# Altium schematic sheet [11] - POWERS.SchDoc: IMXBB
size A3; DocumentNumber: 11; Revision: 2.0; SheetNumber: 11; SheetTotal: 13
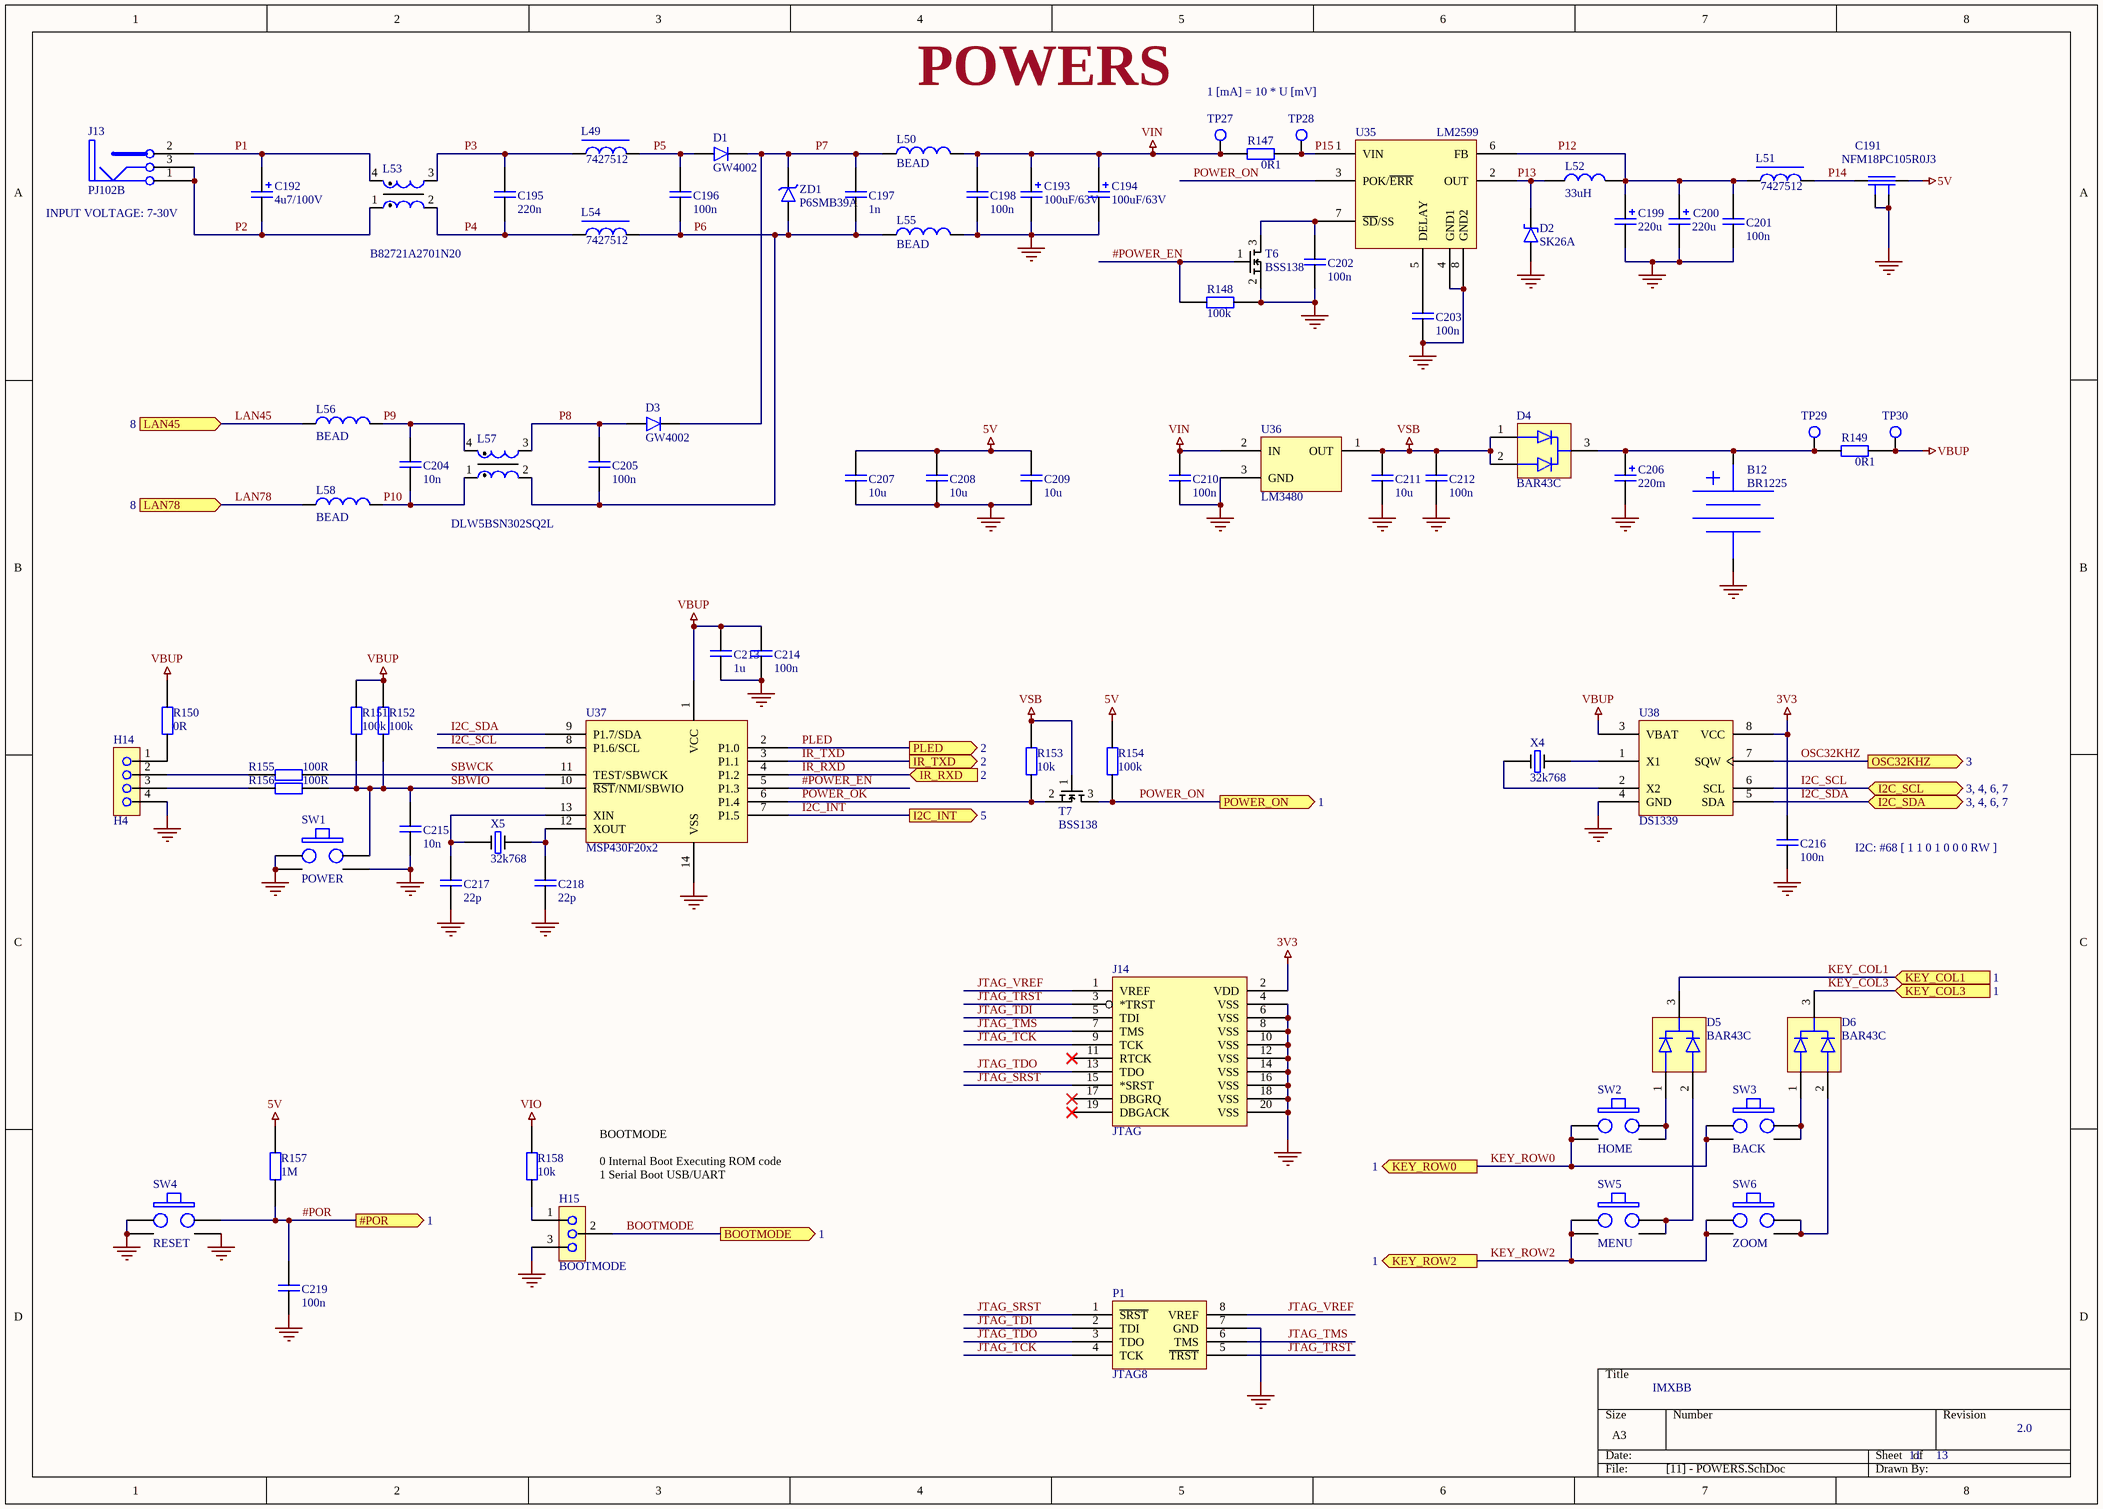
[diagram p0: [11] - POWERS.SchDoc]

## Parts
B12  BR1225  [BR1225]
C191  NFM18PC105R0J3  [NFM18P]
C192  4u7/100V  [EC2/5]
C193  100uF/63V  [EC5/10]
C194  100uF/63V  [EC5/10]
C195  220n  [1206]
C196  100n  [1206]
C197  1n  [0805]
C198  100n  [1206]
C199  220u  [EC5/10]
C200  220u  [EC5/10]
C201  100n  [0603]
C202  100n  [0603]
C203  100n  [0603]
C204  10n  [0603]
C205  100n  [0603]
C206  220m  [SC5/13]
C207  10u  [0805]
C208  10u  [0805]
C209  10u  [0805]
C210  100n  [0603]
C211  10u  [0805]
C212  100n  [0603]
C213  1u  [0603]
C214  100n  [0603]
C215  10n  [0603]
C216  100n  [0603]
C217  22p  [0603]
C218  22p  [0603]
C219  100n  [0603]
D1  GW4002  [MELF]
D2  SK26A  [SMB]
D3  GW4002  [MELF]
D4  BAR43C  [SOT23]
D5  BAR43C  [SOT23]
D6  BAR43C  [SOT23]
H14  H4  [H1x4]
H15  BOOTMODE  [H1x3]
J13  PJ102B  [POWER_JACK_5.5/2.1MM_NS]
J14  JTAG  [H2x10]
L49  7427512  [7427512]
L50  BEAD  [0805]
L51  7427512  [7427512]
L52  33uH  [L127_NS]
L53  B82721A2701N20  [42H17]
L54  7427512  [7427512]
L55  BEAD  [0805]
L56  BEAD  [0805]
L57  DLW5BSN302SQ2L  [DLW5BSN]
L58  BEAD  [0805]
P1  JTAG8  [47041-0001]
R147  0R1  [0603]
R148  100k  [0603]
R149  0R1  [0603]
R150  0R  [0603]
R151  100k  [0603]
R152  100k  [0603]
R153  10k  [0603]
R154  100k  [0603]
R155  100R  [0603]
R156  100R  [0603]
R157  1M  [0603]
R158  10k  [0603]
SW1  POWER  [BUTTON_RA_NS]
SW2  HOME  [BUTTON_KSM61X]
SW3  BACK  [BUTTON_KSM61X]
SW4  RESET  [BUTTON_RA_NS]
SW5  MENU  [BUTTON_KSM61X]
SW6  ZOOM  [BUTTON_KSM61X]
T6  BSS138  [SOT23]
T7  BSS138  [SOT23]
TP27  TESTPOINT  [TESTPOINT_2mm]  (value not drawn)
TP28  TESTPOINT  [TESTPOINT_2mm]  (value not drawn)
TP29  TESTPOINT  [TESTPOINT_2mm]  (value not drawn)
TP30  TESTPOINT  [TESTPOINT_2mm]  (value not drawn)
U35  LM2599  [TO263_7]
U36  LM3480  [SOT23]
U37  MSP430F20x2  [TSSOP14]
U38  DS1339  [uSOP8]
X4  32k768  [SMQ32S]
X5  32k768  [SMQ32S]
ZD1  P6SMB39A  [DO214AA]

## Ports
#POR (out, see 1), BOOTMODE (out, see 1), I2C_INT (out, see 5), I2C_SCL (bidir, see 3, 4, 6, 7), I2C_SDA (bidir, see 3, 4, 6, 7), IR_RXD (in, see 2), IR_TXD (out, see 2), KEY_COL1 (in, see 1), KEY_COL3 (in, see 1), KEY_ROW0 (out, see 1), KEY_ROW2 (out, see 1), LAN45 (in, see 8), LAN78 (in, see 8), OSC32KHZ (out, see 3), PLED (out, see 2), POWER_ON (out, see 1)

## Nets
3V3: C216.2 J14.2(VDD) U38.8(VCC)
5V: C191.3 C207.2 C208.2 C209.2 R154.2 R157.2
GND: B12.2(CATHODE) C191.2 C191.4 C193.2 C194.2 C198.2 C199.2 C200.2 C201.2 C202.1 C203.1 C206.2 C207.1 C208.1 C209.1 C210.1 C211.1 C212.1 C213.1 C214.2 C215.2 C216.1 C217.1 C218.1 C219.1 D2.2 H14.4 H15.3 J14.4(VSS) J14.6(VSS) J14.8(VSS) J14.10(VSS) J14.12(VSS) J14.14(VSS) J14.16(VSS) J14.18(VSS) J14.20(VSS) L55.1 P1.7(GND) R148.1 SW1.2 SW1.3 SW1.4 SW4.2 SW4.3 SW4.4 T6.2(S) U35.4(GND1) U35.8(GND2) U36.3(GND) U37.14(VSS) U38.4(GND)
VBUP: C213.2 C214.1 R149.2 R150.2 R151.2 R152.2 TP30.1 U37.1(VCC) U38.3(VBAT)
VIN: C193.1 C194.1 C198.1 C210.2 L50.1 R147.1 TP27.1 U36.2(IN)
VIO: R158.2
VSB: C211.2 C212.2 D4.1 D4.2 R153.1 T7.1(G) U36.1(OUT)
#POR: C219.2 R157.1 SW4.1 ; port #POR
#POWER_EN: R148.2 T6.1(G) U37.5(P1.3)
BOOTMODE: H15.2 ; port BOOTMODE
I2C_INT: U37.7(P1.5) ; port I2C_INT
I2C_SCL: U37.8(P1.6/SCL) U38.6(SCL) ; port I2C_SCL
I2C_SDA: U37.9(P1.7/SDA) U38.5(SDA) ; port I2C_SDA
IR_RXD: U37.4(P1.2) ; port IR_RXD
IR_TXD: U37.3(P1.1) ; port IR_TXD
JTAG_SRST: J14.15(*SRST) P1.1(~{SRST})
JTAG_TCK: J14.9(TCK) P1.4(TCK)
JTAG_TDI: J14.5(TDI) P1.2(TDI)
JTAG_TDO: J14.13(TDO) P1.3(TDO)
JTAG_TMS: J14.7(TMS) P1.6(TMS)
JTAG_TRST: J14.3(*TRST) P1.5(~{TRST})
JTAG_VREF: J14.1(VREF) P1.8(VREF)
KEY_COL1: D5.3 ; port KEY_COL1
KEY_COL3: D6.3 ; port KEY_COL3
KEY_ROW0: SW2.1 SW2.3 SW3.1 SW3.3 ; port KEY_ROW0
KEY_ROW2: SW5.1 SW5.3 SW6.1 SW6.3 ; port KEY_ROW2
LAN45: L56.1 ; port LAN45
LAN78: L58.1 ; port LAN78
OSC32KHZ: U38.7(SQW) ; port OSC32KHZ
P1: C192.1 J13.2 L53.4
P2: C192.2 J13.1 J13.3 L53.1
P3: C195.1 L49.2 L53.3
P4: C195.2 L53.2 L54.2
P5: C196.1 D1.1 L49.1
P6: C196.2 C197.2 C205.2 L54.1 L55.2 L57.2 ZD1.2
P7: C197.1 D1.2 D3.2 L50.2 ZD1.1
P8: C205.1 D3.1 L57.3
P9: C204.1 L56.2 L57.4
P10: C204.2 L57.1 L58.2
P12: C199.1 C200.1 C201.1 L51.2 L52.2 U35.6(FB)
P13: D2.1 L52.1 U35.2(OUT)
P14: C191.1 L51.1
P15: R147.2 TP28.1 U35.1(VIN)
PLED: U37.2(P1.0) ; port PLED
POWER_OK: R153.2 T7.2(S) U37.6(P1.4)
POWER_ON: R154.1 T7.3(D) U35.3(POK/~{ERR}) ; port POWER_ON
SBWCK: R155.2 U37.11(TEST/SBWCK)
SBWIO: C215.1 R151.1 R152.1 R156.2 SW1.1 U37.10(~{RST}/NMI/SBWIO)
NetB12_1: B12.1(ANODE) C206.1 D4.3 R149.1 TP29.1
NetC202_2: C202.2 T6.3(D) U35.7(~{SD}/SS)
NetC203_2: C203.2 U35.5(DELAY)
NetC217_2: C217.2 U37.13(XIN) X5.1
NetC218_2: C218.2 U37.12(XOUT) X5.2
NetD5_1: D5.1 SW2.2 SW2.4
NetD5_2: D5.2 SW5.2 SW5.4
NetD6_1: D6.1 SW3.2 SW3.4
NetD6_2: D6.2 SW6.2 SW6.4
NetH14_1: H14.1 R150.1
NetH14_2: H14.2 R155.1
NetH14_3: H14.3 R156.1
NetH15_1: H15.1 R158.1
NetU38_1: U38.1(X1) X4.2
NetU38_2: U38.2(X2) X4.1

Not connected (* = marked no-connect by the designer): J14 11(RTCK)* 17(DBGRQ)* 19(DBGACK)*

## Notes on the sheet
- POWERS
- 1 [mA] = 10 * U [mV]
- (near J13) INPUT VOLTAGE: 7-30V
- I2C: #68 [ 1 1 0 1 0 0 0 RW ]
- (near H15) BOOTMODE
  0	Internal Boot	Executing ROM code
  1	Serial Boot	USB/UART

## Library data of the parts
B12 = BATT3V
C191 = NFL21S: Chip EMIFIL; Producer: Murata; Order number: NFM18PC105R0J3; Component class: C; Assembly type: SMT
C192-C194 C199 C200 C206 = C+
C195-C198 C201-C205 C207-C219 = C
D1 D3 = D
D2 = SHD
H15 = H3
J14 = ARMICE20
L49 L51 L54 = 7427512: 5A EMI ferit L; Producer: Wurth Electronic; Order number: 7427512; Component class: L; Assembly type: SMT
L50 L55 L56 L58 = FBEAD
L52 = L
L53 = 42H17: Current compensated choke 2x10mH/700mA; Producer: Epcos; Component class: L; Assembly type: TH; Order number: B82721A2701N20
L57 = DLW5BSN152SQ2L: EMI Suppression filter 1A; Producer: Murata; Component class: L; Assembly type: SMT; Order number: DLW5BSN302SQ2L
R147-R158 = R
SW1-SW6 = PBSW
TP27-TP30 = TESTPOINT: Testpoint pad; Order number: no component; Component class: TP; Producer: n/a; Assembly type: no component
X4 X5 = XTAL
ZD1 = ZD